# Altium schematic sheet MCU.SchDoc
size A3; SheetNumber: 2; SheetTotal: 3
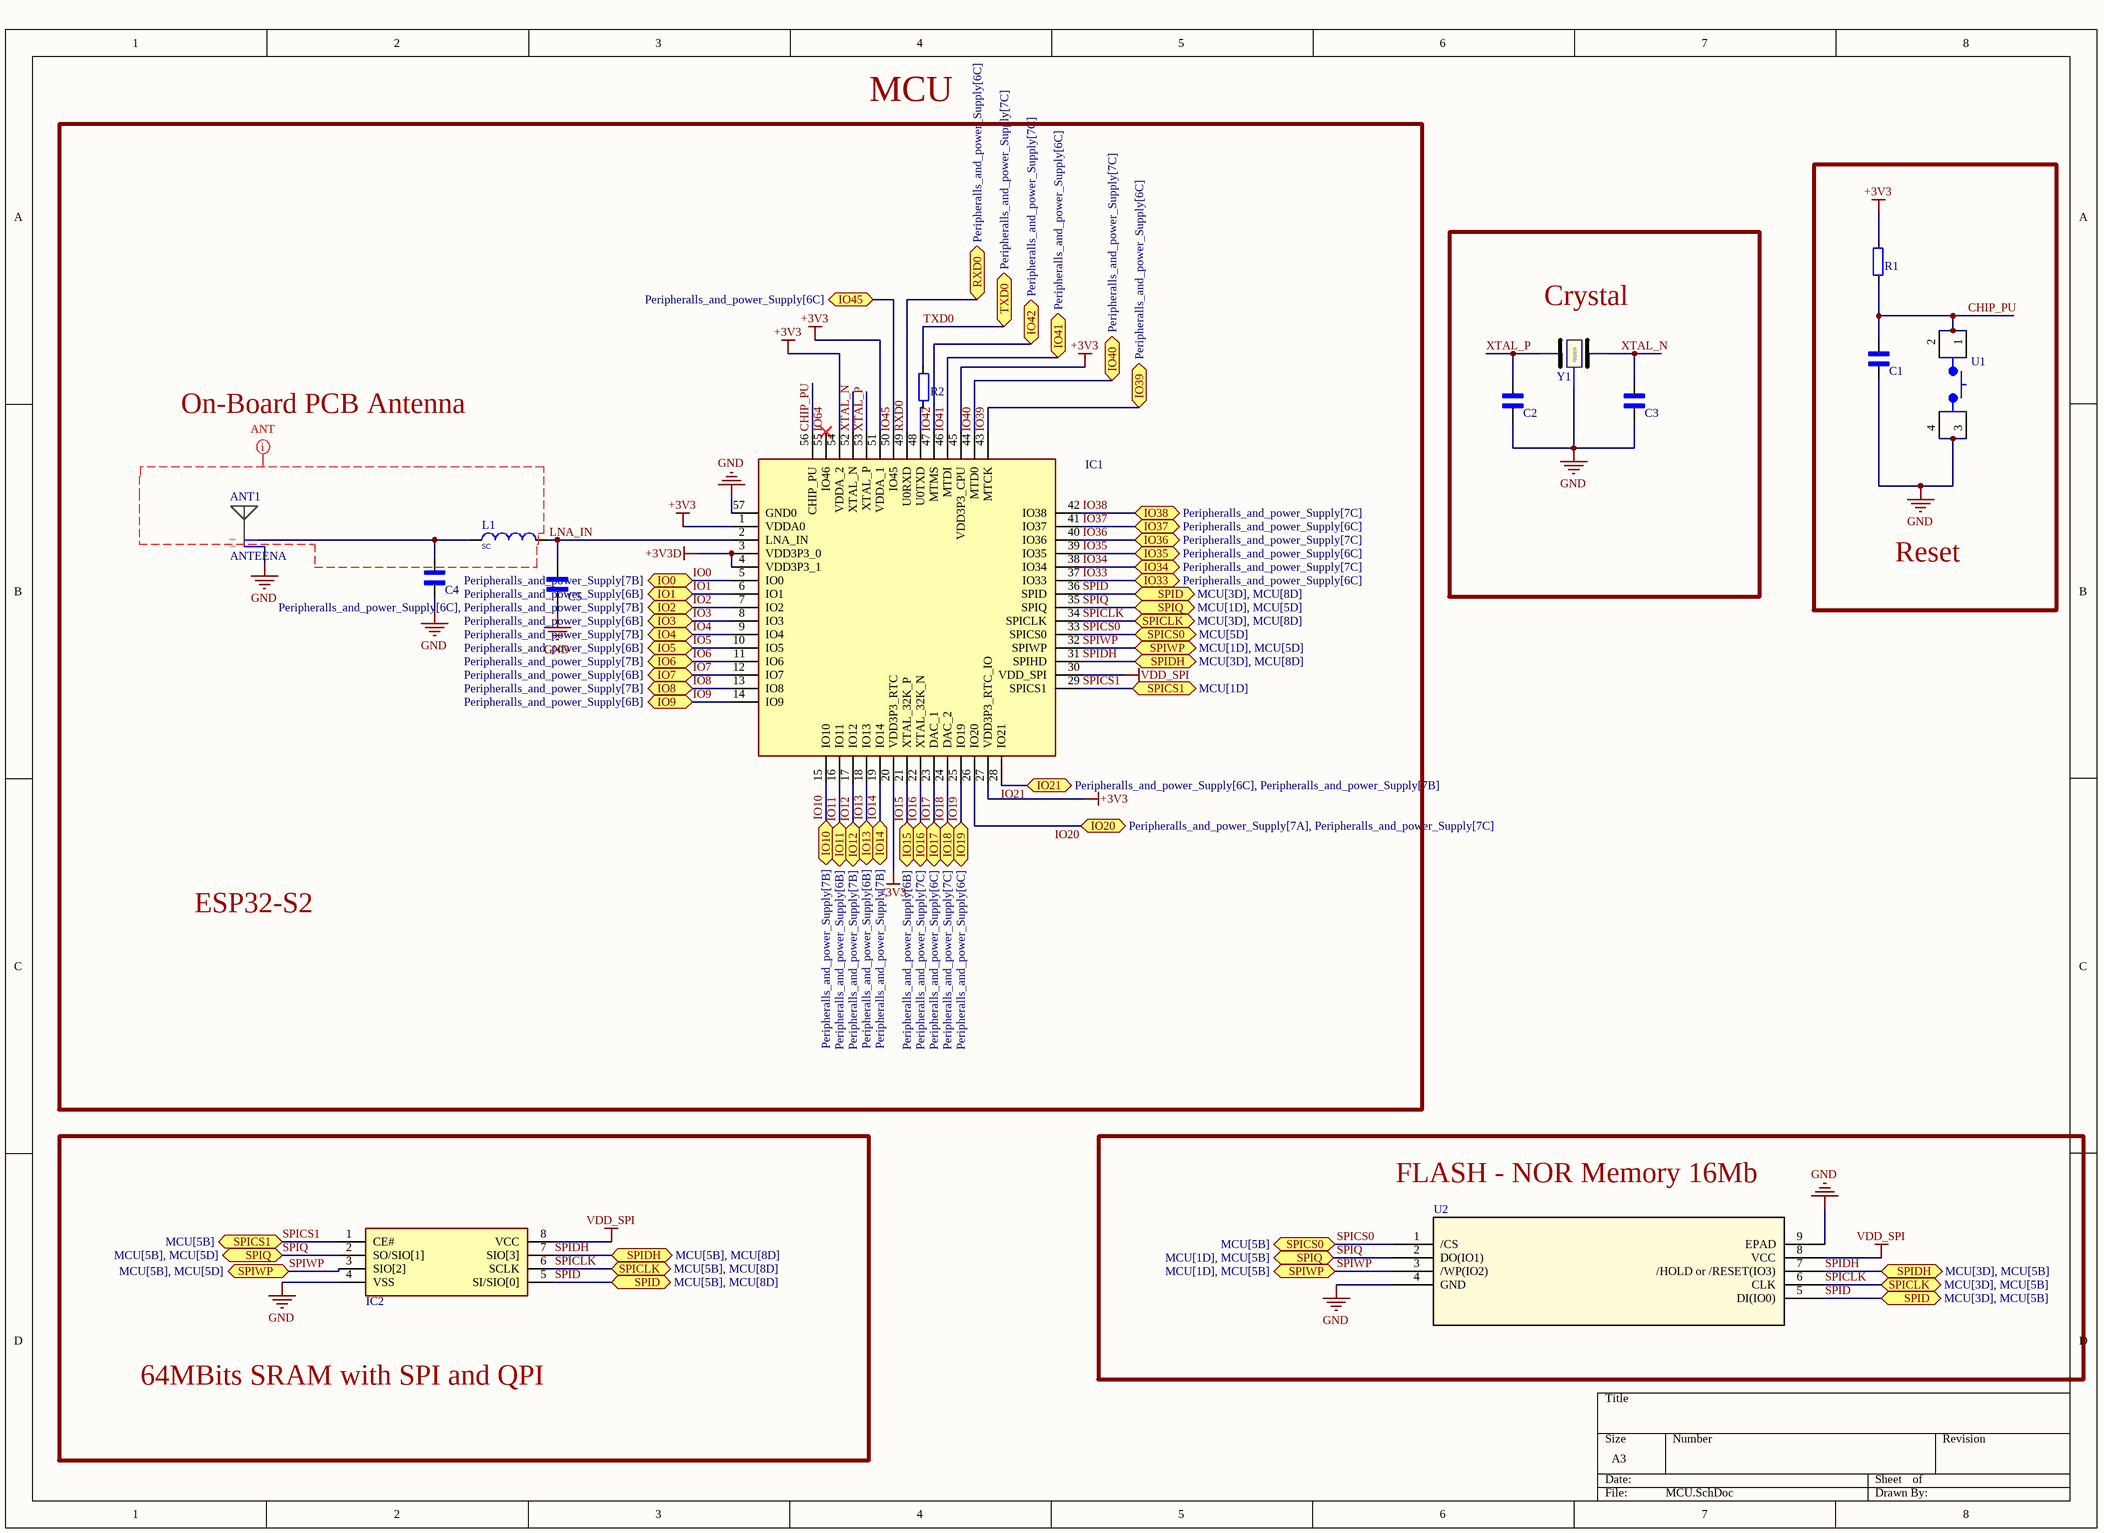
[diagram p0: MCU.SchDoc]

## Parts
ANT1  ANTEENA  [Antenna_2.4GHz]
C1  CAP_0603  [CAP_0603]  (value not drawn)
C2  CAP_0603  [CAP_0603]  (value not drawn)
C3  CAP_0603  [CAP_0603]  (value not drawn)
C4  CAP_0603  [CAP_0603]  (value not drawn)
C5  CAP_0603  [CAP_0603]  (value not drawn)
IC1  ESP32-S2  [QFN-56]  (value not drawn)
IC2  PSRAM  [SOIC8 _PSRAM]  (value not drawn)
L1  value SC  [IND_0402]  (hidden comment: IND_0402)
R1  RES_0603  [RES_0603]  (value not drawn)
R2  RES_0603  [RES_0603]  (value not drawn)
U1  TACT SWITCH  [SW_TL3305AF260QG]  (value not drawn)
U2  NOR FLASH IC  [FLASH USON2x3x0.6mm]  (value not drawn)
Y1  CRYSTAL  [3225_CRYSTA_4P]  (value not drawn)

## Blocks framed on the sheet
MCU: ANT1 C4 C5 IC1 L1 R2
Reset: C1 R1 U1
Crystal: C2 C3 Y1
64MBits SRAM with SPI and QPI: IC2
FLASH - NOR Memory 16Mb: U2

## Ports
IO0 (bidir, see Peripheralls_and_power_Supply[7B]), IO1 (bidir, see Peripheralls_and_power_Supply[6B]), IO2 (bidir, see Peripheralls_and_power_Supply[6C], Peripheralls_and_power_Supply[7B]), IO3 (bidir, see Peripheralls_and_power_Supply[6B]), IO4 (bidir, see Peripheralls_and_power_Supply[7B]), IO5 (bidir, see Peripheralls_and_power_Supply[6B]), IO6 (bidir, see Peripheralls_and_power_Supply[7B]), IO7 (bidir, see Peripheralls_and_power_Supply[6B]), IO8 (bidir, see Peripheralls_and_power_Supply[7B]), IO9 (bidir, see Peripheralls_and_power_Supply[6B]), IO10 (bidir, see Peripheralls_and_power_Supply[7B]), IO11 (bidir, see Peripheralls_and_power_Supply[6B]), IO12 (bidir, see Peripheralls_and_power_Supply[7B]), IO13 (bidir, see Peripheralls_and_power_Supply[6B]), IO14 (bidir, see Peripheralls_and_power_Supply[7B]), IO15 (bidir, see Peripheralls_and_power_Supply[6B]), IO16 (bidir, see Peripheralls_and_power_Supply[7C]), IO17 (bidir, see Peripheralls_and_power_Supply[6C]), IO18 (bidir, see Peripheralls_and_power_Supply[7C]), IO19 (bidir, see Peripheralls_and_power_Supply[6C]), IO20 (bidir, see Peripheralls_and_power_Supply[7A], Peripheralls_and_power_Supply[7C]), IO21 (bidir, see Peripheralls_and_power_Supply[6C], Peripheralls_and_power_Supply[7B]), IO33 (bidir, see Peripheralls_and_power_Supply[6C]), IO34 (bidir, see Peripheralls_and_power_Supply[7C]), IO35 (bidir, see Peripheralls_and_power_Supply[6C]), IO36 (bidir, see Peripheralls_and_power_Supply[7C]), IO37 (bidir, see Peripheralls_and_power_Supply[6C]), IO38 (bidir, see Peripheralls_and_power_Supply[7C]), IO39 (bidir, see Peripheralls_and_power_Supply[6C]), IO40 (bidir, see Peripheralls_and_power_Supply[7C]), IO41 (bidir, see Peripheralls_and_power_Supply[6C]), IO42 (bidir, see Peripheralls_and_power_Supply[7C]), IO45 (bidir, see Peripheralls_and_power_Supply[6C]), RXD0 (bidir, see Peripheralls_and_power_Supply[6C]), SPICLK (bidir, see MCU[3D], MCU[5B]), SPICLK (bidir, see MCU[3D], MCU[8D]), SPICLK (bidir, see MCU[5B], MCU[8D]), SPICS0 (bidir, see MCU[5B]), SPICS0 (bidir, see MCU[5D]), SPICS1 (bidir, see MCU[1D]), SPICS1 (bidir, see MCU[5B]), SPID (bidir, see MCU[3D], MCU[5B]), SPID (bidir, see MCU[3D], MCU[8D]), SPID (bidir, see MCU[5B], MCU[8D]), SPIDH (bidir, see MCU[3D], MCU[5B]), SPIDH (bidir, see MCU[3D], MCU[8D]), SPIDH (bidir, see MCU[5B], MCU[8D]), SPIQ (bidir, see MCU[1D], MCU[5B]), SPIQ (bidir, see MCU[1D], MCU[5D]), SPIQ (bidir, see MCU[5B], MCU[5D]), SPIWP (bidir, see MCU[1D], MCU[5B]), SPIWP (bidir, see MCU[1D], MCU[5D]), SPIWP (bidir, see MCU[5B], MCU[5D]), TXD0 (bidir, see Peripheralls_and_power_Supply[7C])

## Nets
+3V3: IC1.1(VDDA0) IC1.20(VDD3P3_RTC) IC1.27(VDD3P3_RTC_IO) IC1.45(VDD3P3_CPU) IC1.51(VDDA_1) IC1.54(VDDA_2) R1.1
+3V3D: IC1.3(VDD3P3_0) IC1.4(VDD3P3_1)
GND: ANT1.1(GND) C1.2 C2.1 C3.1 C4.1 C5.1 IC1.57(GND0) IC2.4(VSS) U1.3 U1.4 U2.4(GND) U2.9(EPAD) Y1.2
VDD_SPI: IC1.30(VDD_SPI) IC2.8(VCC) U2.8(VCC)
CHIP_PU: C1.1 IC1.56(CHIP_PU) R1.2 U1.1 U1.2
IO0: IC1.5(IO0) ; port IO0
IO1: IC1.6(IO1) ; port IO1
IO2: IC1.7(IO2) ; port IO2
IO3: IC1.8(IO3) ; port IO3
IO4: IC1.9(IO4) ; port IO4
IO5: IC1.10(IO5) ; port IO5
IO6: IC1.11(IO6) ; port IO6
IO7: IC1.12(IO7) ; port IO7
IO8: IC1.13(IO8) ; port IO8
IO9: IC1.14(IO9) ; port IO9
IO10: IC1.15(IO10) ; port IO10
IO11: IC1.16(IO11) ; port IO11
IO12: IC1.17(IO12) ; port IO12
IO13: IC1.18(IO13) ; port IO13
IO14: IC1.19(IO14) ; port IO14
IO15: IC1.21(XTAL_32K_P) ; port IO15
IO16: IC1.22(XTAL_32K_N) ; port IO16
IO17: IC1.23(DAC_1) ; port IO17
IO18: IC1.24(DAC_2) ; port IO18
IO19: IC1.25(IO19) ; port IO19
IO20: IC1.26(IO20) ; port IO20
IO21: IC1.28(IO21) ; port IO21
IO33: IC1.37(IO33) ; port IO33
IO34: IC1.38(IO34) ; port IO34
IO35: IC1.39(IO35) ; port IO35
IO36: IC1.40(IO36) ; port IO36
IO37: IC1.41(IO37) ; port IO37
IO38: IC1.42(IO38) ; port IO38
IO39: IC1.43(MTCK) ; port IO39
IO40: IC1.44(MTD0) ; port IO40
IO41: IC1.46(MTDI) ; port IO41
IO42: IC1.47(MTMS) ; port IO42
IO45: IC1.50(IO45) ; port IO45
IO64: IC1.55(IO46)
LNA_IN: C5.2 IC1.2(LNA_IN) L1.2
RXD0: IC1.49(U0RXD) ; port RXD0
SPICLK: IC1.34(SPICLK) IC2.6(SCLK) U2.6(CLK) ; port SPICLK
SPICS0: IC1.33(SPICS0) U2.1(/CS) ; port SPICS0
SPICS1: IC1.29(SPICS1) IC2.1(CE#) ; port SPICS1
SPID: IC1.36(SPID) IC2.5(SI/SIO[0]) U2.5(DI(IO0)) ; port SPID
SPIDH: IC1.31(SPIHD) IC2.7(SIO[3]) U2.7(/HOLD_or_/RESET(IO3)) ; port SPIDH
SPIQ: IC1.35(SPIQ) IC2.2(SO/SIO[1]) U2.2(DO(IO1)) ; port SPIQ
SPIWP: IC1.32(SPIWP) IC2.3(SIO[2]) U2.3(/WP(IO2)) ; port SPIWP
TXD0: R2.2 ; port TXD0
XTAL_N: C3.2 IC1.52(XTAL_N) Y1.1
XTAL_P: C2.2 IC1.53(XTAL_P) Y1.3
NetANT1_2: ANT1.2(FEED) C4.2 L1.1
NetIC1_48: IC1.48(U0TXD) R2.1

## Layout directives
net class ANT: GND

## Notes on the sheet
- On-Board PCB Antenna
- ESP32-S2
- (in symbol CRYSTAL_40MhZ_10ppm_15pF) 40MHz

## Library data of the parts
IC1 = ESP32-S2: SMD WI-FI IC, ESP32-S2, SINGAL-C; MF: Espressif Systems; Value: *; Package: None; Price: None; MP: ESP32-S2
IC2 = LY68L6400SLIT: SOP-8_150mil  SRAM ROHS; Manufacturer_Name: Lyontek Inc.; Datasheet Link: https://datasheet.lcsc.com/szlcsc/Lyontek-Inc-LY68L6400SLIT_C261881.pdf; Height: 1.75mm; Manufacturer_Part_Number: LY68L6400SLIT
L1 = IND_2.0nH_0402: Inductor RF Chip Multi-Layer 2nH 0.3nH 100MHz 8Q-Factor Air 900mA 90mOhm DCR 0402 Automotive T/R; MP: LQG15HZ2N0S02D; Package: None; Price: None; Availability: Unavailable
U1 = TL3305AF260QG: Tactile Switch SPST-NO Top Actuated Surface Mount; MF: E-Switch; Price: None; Value: *; Purchase-URL: https://pricing.snapeda.com/search/part/TL3305AF260QG/?ref=eda; Check_prices: https://www.snapeda.com/parts/TL3305AF260QG/E-Switch/view-part/?ref=eda; Package: SMD-4 E-Switch; Availability: In Stock; SnapEDA_Link: https://www.snapeda.com/parts/TL3305AF260QG/E-Switch/view-part/?ref=snap; MP: TL3305AF260QG
U2 = W25Q16JVUXIQ: FLASH - NOR Memory IC 16Mb (2M x 8) SPI - Quad I/O 133 MHz 6 ns 8-USON (2x3); Mfr_Name: Winbond; Copyright: Copyright (C) 2022 Ultra Librarian. All rights reserved.; Manufacturer_Part_Number: W25Q16JVUXIQ; RefDes: RefDes; Type: DEV
Y1 = CRYSTAL_40MhZ_10ppm_15pF
C1-C5 = CAP_0603: Package: 1608 AVX